# Altium schematic sheet Regulation_Charging.SchDoc
size A3; Organization: Altium Limited; Address1: L3, 12a Rodborough Rd; Address2: Frenchs Forest; Address3: NSW; Address4: Australia 2086; DocumentNumber: 6; SheetNumber: 6; SheetTotal: 8
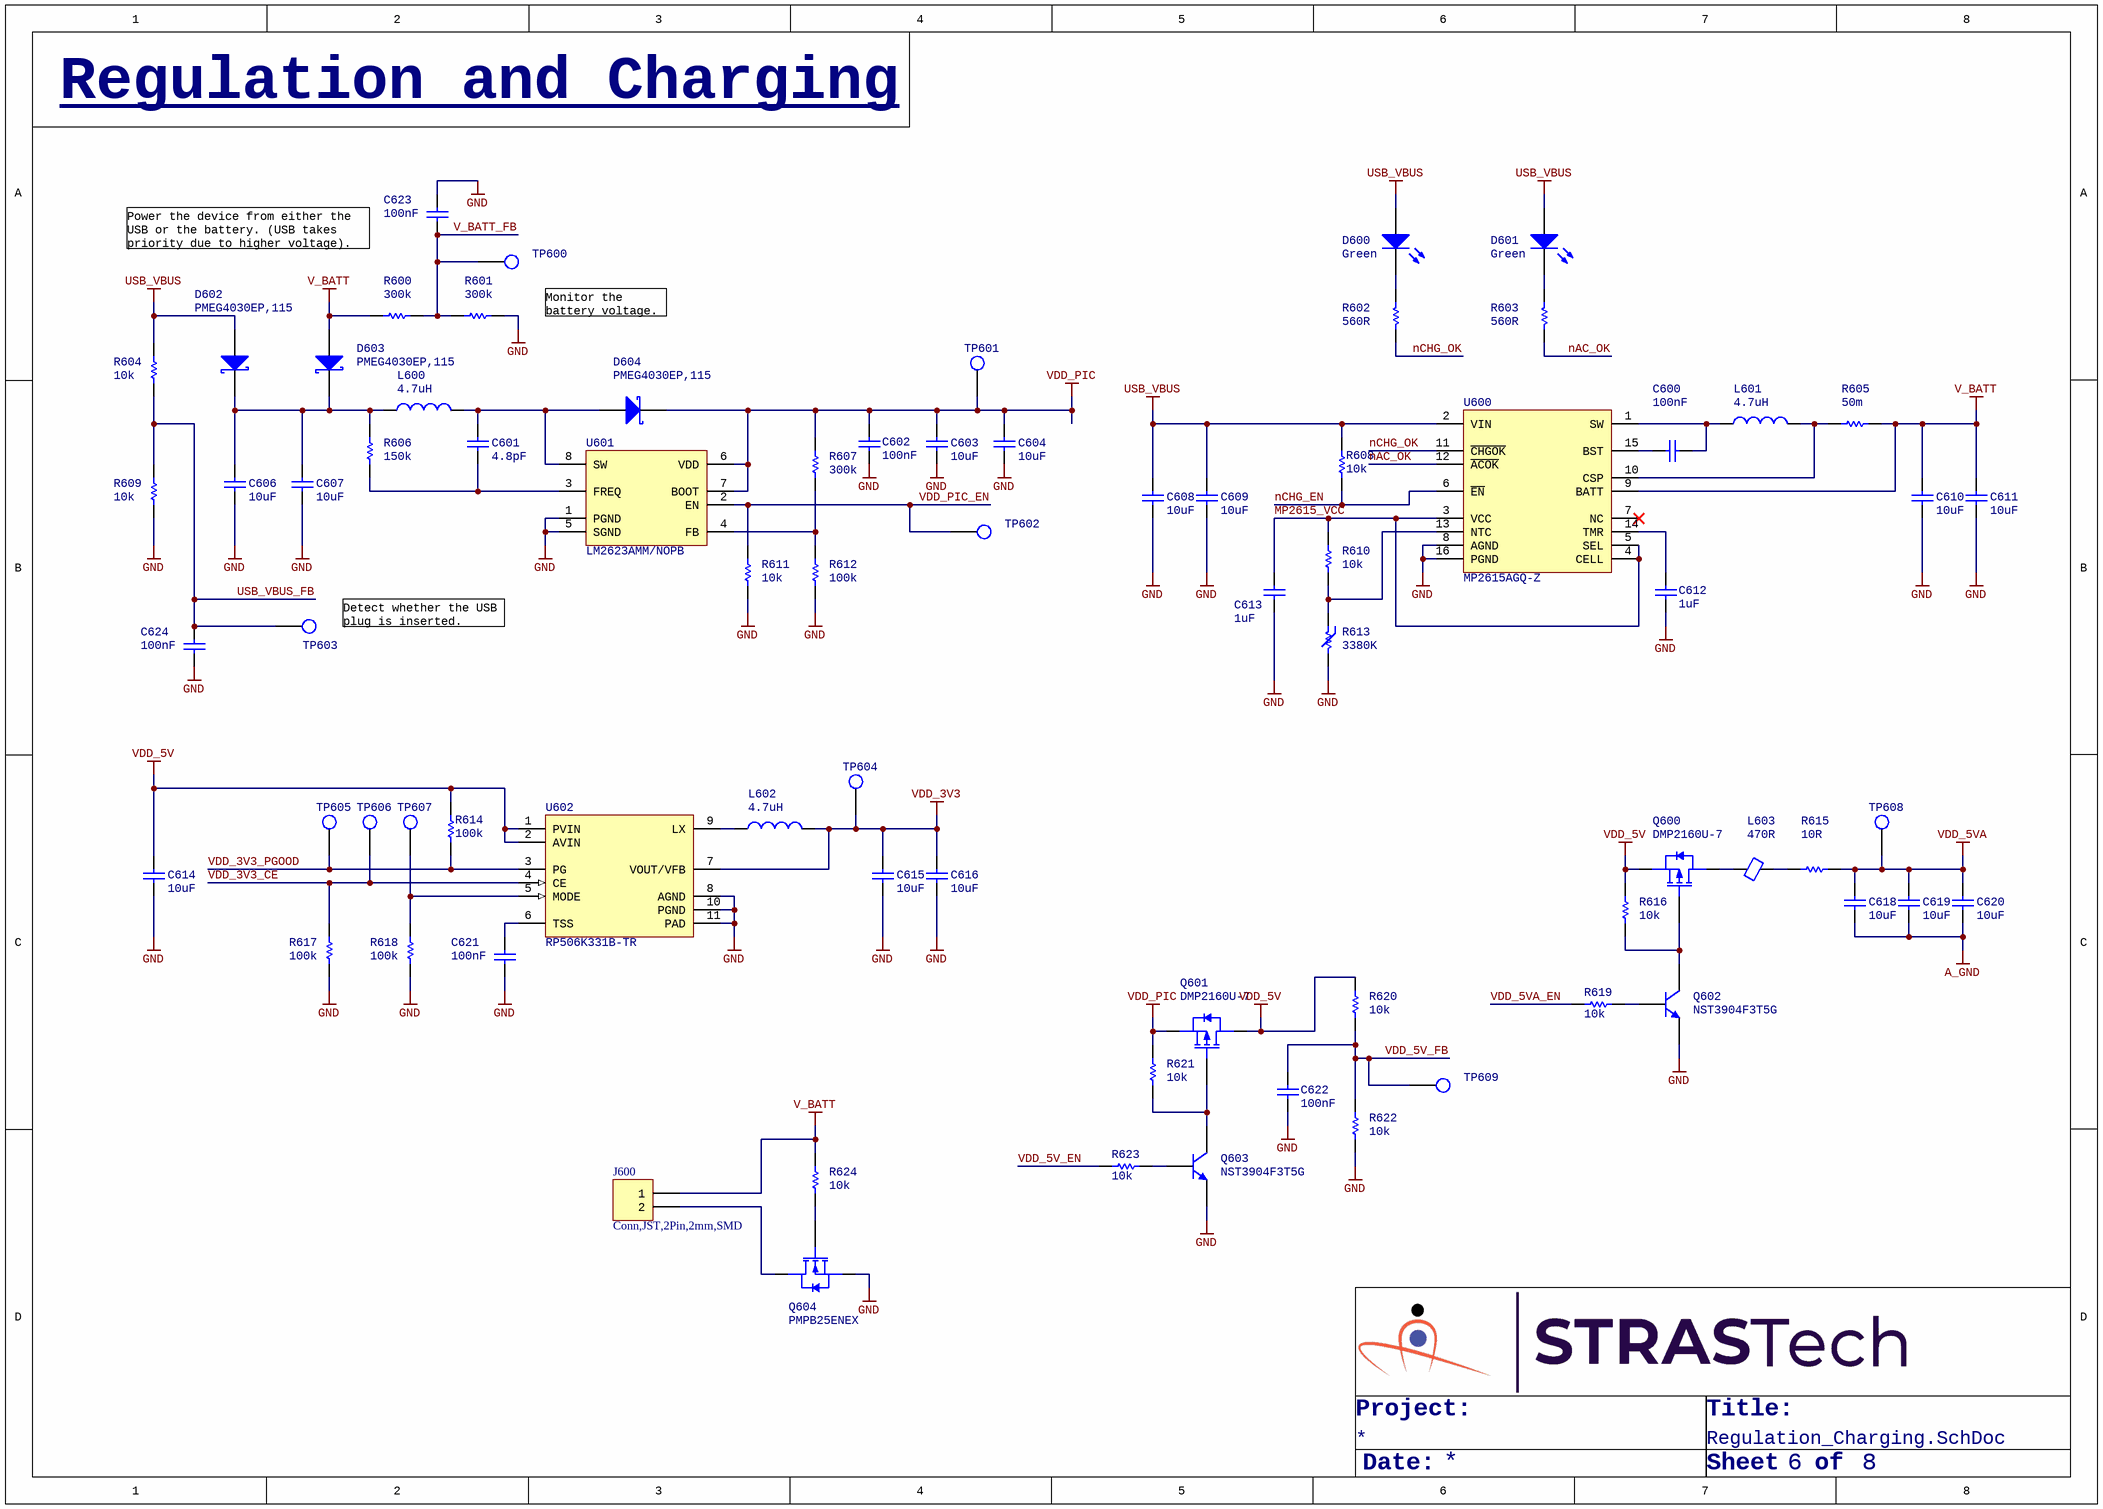
[diagram p0: Regulation_Charging.SchDoc]

## Parts
C600  100nF  [Cap,SMD,0402]
C601  4.8pF  [Cap,SMD,0402]
C602  100nF  [Cap,SMD,0402]
C603  10uF  [Cap,SMD,0402]
C604  10uF  [Cap,SMD,0402]
C606  10uF  [Cap,SMD,0402]
C607  10uF  [Cap,SMD,0402]
C608  10uF  [Cap,SMD,0402]
C609  10uF  [Cap,SMD,0402]
C610  10uF  [Cap,SMD,0402]
C611  10uF  [Cap,SMD,0402]
C612  1uF  [Cap,SMD,0402]
C613  1uF  [Cap,SMD,0402]
C614  10uF  [Cap,SMD,0402]
C615  10uF  [Cap,SMD,0402]
C616  10uF  [Cap,SMD,0402]
C618  10uF  [Cap,SMD,0402]
C619  10uF  [Cap,SMD,0402]
C620  10uF  [Cap,SMD,0402]
C621  100nF  [Cap,SMD,0402]
C622  100nF  [Cap,SMD,0402]
C623  100nF  [Cap,SMD,0402]
C624  100nF  [Cap,SMD,0402]
D600  Green  [LED,0603]
D601  Green  [LED,0603]
D602  PMEG4030EP,115  [SOD128]
D603  PMEG4030EP,115  [SOD128]
D604  PMEG4030EP,115  [SOD128]
J600  Conn,JST,2Pin,2mm,SMD  [Conn,JST,2Pin,2mm,SMD]
L600  4.7uH  [IND,WIREWOUND,4.9x4.9,SMD]
L601  4.7uH  [IND,WIREWOUND,4.9x4.9,SMD]
L602  4.7uH  [IND,WIREWOUND,4.9x4.9,SMD]
L603  470R  [IND,0402]
Q600  DMP2160U-7  [SOT23-3]
Q601  DMP2160U-7  [SOT23-3]
Q602  NST3904F3T5G  [SOT1123]
Q603  NST3904F3T5G  [SOT1123]
Q604  PMPB25ENEX  [IC,WDFN-6,P0.65]
R600  300k  [RES,0402]
R601  300k  [RES,0402]
R602  560R  [RES,0402]
R603  560R  [RES,0402]
R604  10k  [RES,0402]
R605  50m  [RES,1206]
R606  150k  [RES,0402]
R607  300k  [RES,0402]
R608  10k  [RES,0402]
R609  10k  [RES,0402]
R610  10k  [RES,0402]
R611  10k  [RES,0402]
R612  100k  [RES,0402]
R613  3380K  [RES,0402]
R614  100k  [RES,0402]
R615  10R  [RES,0402]
R616  10k  [RES,0402]
R617  100k  [RES,0402]
R618  100k  [RES,0402]
R619  10k  [RES,0402]
R620  10k  [RES,0402]
R621  10k  [RES,0402]
R622  10k  [RES,0402]
R623  10k  [RES,0402]
R624  10k  [RES,0402]
TP600  TESTPOINT  [testpoint,smd,round,1mm]  (value not drawn)
TP601  TESTPOINT  [testpoint,smd,round,1mm]  (value not drawn)
TP602  TESTPOINT  [testpoint,smd,round,1mm]  (value not drawn)
TP603  TESTPOINT  [testpoint,smd,round,1mm]  (value not drawn)
TP604  TESTPOINT  [testpoint,smd,round,1mm]  (value not drawn)
TP605  TESTPOINT  [testpoint,smd,round,1mm]  (value not drawn)
TP606  TESTPOINT  [testpoint,smd,round,1mm]  (value not drawn)
TP607  TESTPOINT  [testpoint,smd,round,1mm]  (value not drawn)
TP608  TESTPOINT  [testpoint,smd,round,1mm]  (value not drawn)
TP609  TESTPOINT  [testpoint,smd,round,1mm]  (value not drawn)
U600  MP2615AGQ-Z  [IC,QFN-16,3x3,P5x3]
U601  LM2623AMM/NOPB  [IC,TSSOP-8,W3.0]
U602  RP506K331B-TR  [IC,DFN-10_3x3,P0.5mm]

## Nets
A_GND: C618.1 C619.1 C620.1
GND: C602.2 C603.1 C604.1 C606.1 C607.1 C608.1 C609.1 C610.1 C611.1 C612.2 C613.1 C614.1 C615.1 C616.1 C621.1 C622.2 C623.2 C624.1 Q602.2(E) Q603.2(E) Q604.3(S) R601.1 R609.1 R611.1 R612.1 R613.2 R617.1 R618.2 R622.1 U600.8(AGND) U600.16(PGND) U601.1(PGND) U601.5(SGND) U602.8(AGND) U602.10(PGND) U602.11(PAD)
USB_VBUS: C608.2 C609.2 D600.1(A) D601.1(A) D602.2(A) R604.2 R608.1 U600.2(VIN)
V_BATT: C610.2 C611.2 D603.2(A) J600.1 R600.2 R605.2 R624.2 U600.9(BATT)
VDD_3V3: C615.2 C616.2 L602.2 TP604.1(TP) U602.7(VOUT/VFB)
VDD_5V: C614.2 Q600.2(S) Q601.3(D) R614.2 R616.2 R620.2 U602.1(PVIN) U602.2(AVIN)
VDD_5VA: C618.2 C619.2 C620.2 R615.2 TP608.1(TP)
VDD_PIC: C602.1 C603.2 C604.2 D604.1(K) Q601.2(S) R607.2 R621.2 TP601.1(TP) U601.6(VDD) U601.7(BOOT)
MP2615_VCC: C613.2 R610.1 U600.3(VCC) U600.4(CELL) U600.5(SEL)
nAC_OK: R603.2 U600.12(~{ACOK})
nCHG_EN: R608.2 U600.6(~{EN})
nCHG_OK: R602.2 U600.11(~{CHGOK})
USB_VBUS_FB: C624.2 R604.1 R609.2 TP603.1(TP)
V_BATT_FB: C623.1 R600.1 R601.2 TP600.1(TP)
VDD_3V3_CE: R617.2 TP606.1(TP) U602.4(CE)
VDD_3V3_PGOOD: R614.1 TP605.1(TP) U602.3(PG)
VDD_5V_EN: R623.2
VDD_5V_FB: C622.1 R620.1 R622.2 TP609.1(TP)
VDD_5VA_EN: R619.2
VDD_PIC_EN: R611.2 TP602.1(TP) U601.2(EN)
NetC600_1: C600.1 L601.1 U600.1(SW)
NetC600_2: C600.2 U600.15(BST)
NetC601_1: C601.1 R606.1 U601.3(FREQ)
NetC601_2: C601.2 D604.2(A) L600.2 U601.8(SW)
NetC606_2: C606.2 C607.2 D602.1(K) D603.1(K) L600.1 R606.2
NetC612_1: C612.1 U600.14(TMR)
NetC621_2: C621.2 U602.6(TSS)
NetD600_2: D600.2(K) R602.1
NetD601_2: D601.2(K) R603.1
NetJ600_2: J600.2 Q604.1(D)
NetL601_2: L601.2 R605.1 U600.10(CSP)
NetL602_1: L602.1 U602.9(LX)
NetL603_1: L603.1 Q600.3(D)
NetL603_2: L603.2 R615.1
NetQ600_1: Q600.1(G) Q602.3(C) R616.1
NetQ601_1: Q601.1(G) Q603.3(C) R621.1
NetQ602_1: Q602.1(B) R619.1
NetQ603_1: Q603.1(B) R623.1
NetQ604_2: Q604.2(G) R624.1
NetR607_1: R607.1 R612.2 U601.4(FB)
NetR610_2: R610.2 R613.1 U600.13(NTC)
NetR618_1: R618.1 TP607.1(TP) U602.5(MODE)

Not connected (* = marked no-connect by the designer): U600 7(NC)*

## Notes on the sheet
- Regulation and Charging
- Power the device from either the USB or the battery. (USB takes priority due to higher voltage).
- Monitor the battery voltage.
- (near TP603) Detect whether the USB plug is inserted.
- Project:
- Title:
- Date:
- Sheet
- of
- Title
- Size:
- A3
- Revision:
- Design By:

## Library data of the parts
C600 C602 C621-C624 = CAP,Cer,100nF,25VDC,X7R,0402: 0.1µF ±10% 25V Ceramic Capacitor X7R 0402 (1005 Metric); Vendor Part Number: 490-14603-1-ND; Manufacturer: Murata Electronics; Manufacturer Part Number: GRM155R71E104KE14J; Vendor: Digikey; HelpURL: https://search.murata.co.jp/Ceramy/image/img/A01X/G101/ENG/GRM155R71E104KE14-01.pdf; CreatedBy: Judd Foster
C601 = CAP,Cer,4.8pF,50VDC,C0G/NP0,0402: 4.8 pF ±0.25pF 50V Ceramic Capacitor C0G, NP0 0402 (1005 Metric); Vendor Part Number: 490-17481-1-ND; Manufacturer: Murata Electronics; Manufacturer Part Number: GCQ1555C1H4R8CB01D; Vendor: Digikey; HelpURL: https://search.murata.co.jp/Ceramy/image/img/A01X/G101/ENG/GCQ1555C1H4R8CB01-01.pdf; CreatedBy: Judd Foster
C603 C604 C606-C611 C614-C616 C618-C620 = CAP,Cer,10uF,10VDC,X5R,0402: 10 µF ±20% 10V Ceramic Capacitor X5R 0402 (1005 Metric); Vendor Part Number: 1276-1450-1-ND; Manufacturer: Samsung Electro-Mechanics; Manufacturer Part Number: CL05A106MP5NUNC; Vendor: Digikey; HelpURL: https://media.digikey.com/pdf/Data%20Sheets/Samsung%20PDFs/CL05A106MP5NUNC_Spec.pdf; CreatedBy: Judd Foster
C612 C613 = CAP,Cer,1uF,35VDC,X5R,0402: 1 µF ±10% 35V Ceramic Capacitor X5R 0402 (1005 Metric); Vendor Part Number: 445-9073-1-ND; Manufacturer: TDK Corporation; Manufacturer Part Number: C1005X5R1V105K050BC; Vendor: Digikey; HelpURL: https://product.tdk.com/info/en/catalog/datasheets/mlcc_commercial_general_en.pdf?ref_disty=digikey; CreatedBy: Judd Foster
D600 D601 = LED,Green,SMD,0603: Green 530nm LED Indication - Discrete 3V 0603 (1608 Metric); Manufacturer: Stanley Electric Co; Manufacturer Part Number: THG1111C-0005-TR; Vendor Part Number: 404-1286-1-ND; Vendor: Digikey; CreatedBy: Judd Foster; HelpURL: http://www.stanley-components.com/php/downloaddatafile.php?rp=0,THG1111C-0005_e.pdf
D602-D604 = DIODE,Schottky,40V,3A,SMD: Diode Schottky 40V 3A Surface Mount CFP5; Manufacturer: Nexperia USA Inc.; Vendor Part Number: 1727-5841-1-ND; Vendor: Digikey; CreatedBy: Judd Foster; HelpURL: https://assets.nexperia.com/documents/data-sheet/PMEG4030EP.pdf; Manufacturer Part Number: PMEG4030EP,115
J600 = Conn,JST,2Pin,2mm,SMD: Connector Header Surface Mount, Right Angle 2 position 0.079" (2.00mm); Vendor Part Number: H125443CT-ND; Manufacturer: Hirose Electric Co Ltd; Manufacturer Part Number: DF3EA-2P-2H(21); Vendor: Digikey; HelpURL: https://www.hirose.com/product/document?clcode=CL0543-0329-0-21&productname=DF3EA-2P-2H(21)&series=DF3&documenttype=2DDrawing&lang=en&documentid=0001258196; Created By: Judd Foster
L600-L602 = IND,4.7uH,2.6A,Wirewound,SMD: 4.7µH Shielded Wirewound Inductor 2.6A 45.5mOhm Max Nonstandard; Vendor Part Number: 587-3605-1-ND; Manufacturer: Taiyo Yuden; Manufacturer Part Number: NRS5030T4R7MMGJV; Vendor: Digikey; HelpURL: https://ds.yuden.co.jp/TYCOMPAS/ut/detail?pn=NRS5030T4R7MMGJV%20%20&u=M; CreatedBy: Judd Foster
L603 = Ferrite,470R@100MHz,0402: 470 Ohms @ 100 MHz 1 Power Line Ferrite Bead 0402 (1005 Metric) 1A 200mOhm; Vendor Part Number: 490-10662-1-ND; Manufacturer: Murata Electronics; Manufacturer Part Number: BLM15PX471SN1D; Vendor: Digikey; HelpURL: https://www.murata.com/en-us/products/productdata/8796740059166/ENFA0018.pdf; CreatedBy: Judd Foster
Q600 Q601 = MOSFET,P Ch,20V,3.2A: P-Channel 20 V 3.2A (Ta) 1.4W (Ta) Surface Mount SOT-23-3; Manufacturer: Diodes Incorporated; Vendor Part Number: DMP2160UDICT-ND; Vendor: Digikey; CreatedBy: Judd Foster; HelpURL: https://media.digikey.com/pdf/Data%20Sheets/Diodes%20PDFs/DMP2160U.pdf; Manufacturer Part Number: DMP2160U-7
Q602 Q603 = Trans,NPN,40V,200mA,SOT1123: Bipolar (BJT) Transistor NPN 40 V 200 mA 200MHz 290 mW Surface Mount SOT-1123; Manufacturer: ON Semiconductor; Vendor Part Number: NST3904F3T5GOSCT-ND; Vendor: Digikey; CreatedBy: Judd Foster; HelpURL: https://www.onsemi.com/pdf/datasheet/nst3904f3-d.pdf; Manufacturer Part Number: NST3904F3T5G
Q604 = MOSFET,N Ch,30V,10A: N-Channel 30 V 10A (Ta) 2.1W (Ta) Surface Mount DFN2020MD-6; Manufacturer: Nexperia USA Inc.; Vendor Part Number: 1727-7662-1-ND; Vendor: Digikey; CreatedBy: Ritesh Nandakumar; HelpURL: https://assets.nexperia.com/documents/data-sheet/PMPB25ENE.pdf; Manufacturer Part Number: PMPB25ENEX
R600 R601 R607 = RES,300k,1%,0.063W,0402: 300 kOhms ±1% 0.063W, 1/16W Chip Resistor 0402 (1005 Metric) Automotive AEC-Q200 Thick Film; Manufacturer: Stackpole Electronics Inc; Manufacturer Part Number: RMCF0402FT300K; Vendor Part Number: RMCF0402FT300KCT-ND; Vendor: Digikey; CreatedBy: Judd Foster; HelpURL: https://www.seielect.com/catalog/sei-rmcf_rmcp.pdf
R602 R603 = RES,560R,1%,0.063W,0402: 560 Ohms ±1% 0.063W, 1/16W Chip Resistor 0402 (1005 Metric) Automotive AEC-Q200, Moisture Resistant Thick Film; Manufacturer: TE Connectivity Passive Product; Manufacturer Part Number: CRGCQ0402F560R; Vendor Part Number: A129624CT-ND; Vendor: Digikey; CreatedBy: Judd Foster; HelpURL: https://www.te.com/commerce/DocumentDelivery/DDEController?Action=srchrtrv&DocNm=1773204-3&DocType=DS&DocLang=English
R604 R608-R611 R616 R619-R624 = RES,10k,5%,0.063W,0402: 10 kOhms ±5% 0.063W, 1/16W Chip Resistor 0402 (1005 Metric) Automotive AEC-Q200 Thick Film; Vendor Part Number: RMCF0402JT10K0CT-ND; Manufacturer: Stackpole Electronics Inc; Manufacturer Part Number: RMCF0402JT10K0; Vendor: DIgikey; HelpURL: https://www.seielect.com/catalog/sei-rmcf_rmcp.pdf; CreatedBy: Judd Foster
R605 = RES,50m,1%,0.5W,1206: 50 mOhms ±1% 0.5W, 1/2W Chip Resistor 1206 (3216 Metric) Current Sense Metal Film; Manufacturer: Ohmite; Manufacturer Part Number: KDV12FR050ET; Vendor Part Number: 273-KDV12FR050ETCT-ND; Vendor: Digikey; CreatedBy: Judd Foster; HelpURL: https://www.ohmite.com/assets/docs/res_kdv.pdf?r=false
R606 = RES,150k,1%,0.1W,0402: 150 kOhms ±1% 0.063W, 1/16W Chip Resistor 0402 (1005 Metric) Automotive AEC-Q200 Thick Film; Manufacturer: Stackpole Electronics Inc; Manufacturer Part Number: RMCF0402FT150K; Vendor Part Number: RMCF0402FT150KCT-ND; Vendor: Digikey; CreatedBy: Judd Foster; HelpURL: https://www.seielect.com/catalog/sei-rmcf_rmcp.pdf
R612 R614 R617 R618 = RES,100k,5%,0.1W,0402: 100 kOhms ±5% 0.1W, 1/10W Chip Resistor 0402 (1005 Metric) Automotive AEC-Q200 Thick Film; Manufacturer: Panasonic Electronic Components; Manufacturer Part Number: ERJ-2GEJ104X; Vendor Part Number: P100KJCT-ND; Vendor: Digikey; CreatedBy: Judd Foster; HelpURL: https://b2b-api.panasonic.eu/file_stream/pids/fileversion/1242
R613 = RES,Thermistor,3380K,0402: NTC Thermistor 10k 0402 (1005 Metric); Manufacturer: Murata Electronics; Manufacturer Part Number: NCU15XH103J6SRC; Vendor Part Number: 490-NCU15XH103J6SRCCT-ND; Vendor: Digikey; CreatedBy: Judd Foster; HelpURL: https://www.murata.com/en-us/api/pdfdownloadapi?cate=luNTCforTempeSenso&partno=NCU15XH103J6SRC
R615 = RES,10R,1%,0.063W,0402: 10 Ohms ±1% 0.063W, 1/16W Chip Resistor 0402 (1005 Metric) Automotive AEC-Q200 Thick Film; Manufacturer: Panasonic Electronic Components; Manufacturer Part Number: ERJ-2RKF10R0X; Vendor Part Number: P10.0LCT-ND; Vendor: Digikey; CreatedBy: Judd Foster; HelpURL: https://industrial.panasonic.com/cdbs/www-data/pdf/RDA0000/AOA0000C304.pdf
TP600-TP609 = TESTPOINT: PCB Testpoint; CreatedBy: Judd Foster; HelpURL: N/A; Manufacturer: N/A; Manufacturer Part Number: N/A; Vendor: N/A; Vendor Part Number: N/A
U600 = MP2615AGQ-Z: Charger IC Lithium Ion/Polymer 16-QFN (3x3); Manufacturer: Monolithic Power Systems Inc.; Vendor Part Number: 1589-MP2615AGQ-ZCT-ND; Vendor: Digikey; CreatedBy: Judd Foster; HelpURL: https://www.monolithicpower.com/en/documentview/productdocument/index/version/2/document_type/Datasheet/lang/en/sku/MP2615AGQ-Z/document_id/1433/; Manufacturer Part Number: MP2615AGQ-Z
U601 = LM2623AMM/NOPB: Boost Switching Regulator IC Positive Adjustable 1.24V 1 Output 2.2A (Switch) 8-TSSOP, 8-MSOP (0.118", 3.00mm Width); Vendor Part Number: LM2623AMM/NOPBCT-ND; Manufacturer: Texas Instruments; Vendor: Digikey; Manufacturer Part Number: LM2623AMM/NOPB; HelpURL: https://www.ti.com/general/docs/suppproductinfo.tsp?distId=10&gotoUrl=https%3A%2F%2Fwww.ti.com%2Flit%2Fgpn%2Flm2623; CreatedBy: Judd Foster
U602 = RP506K331B-TR: Buck Switching Regulator IC Positive Fixed 3.3V 1 Output 2A 10-UFDFN Exposed Pad; Manufacturer: Nisshinbo Micro Devices Inc.; Vendor Part Number: 2129-RP506K331B-CT-ND; Vendor: Digikey; CreatedBy: Judd Foster; HelpURL: https://www.nisshinbo-microdevices.co.jp/en/pdf/datasheet/rp506-ea.pdf; Manufacturer Part Number: RP506K331B-TR